# Altium schematic sheet stm32f407.SchDoc
size A3
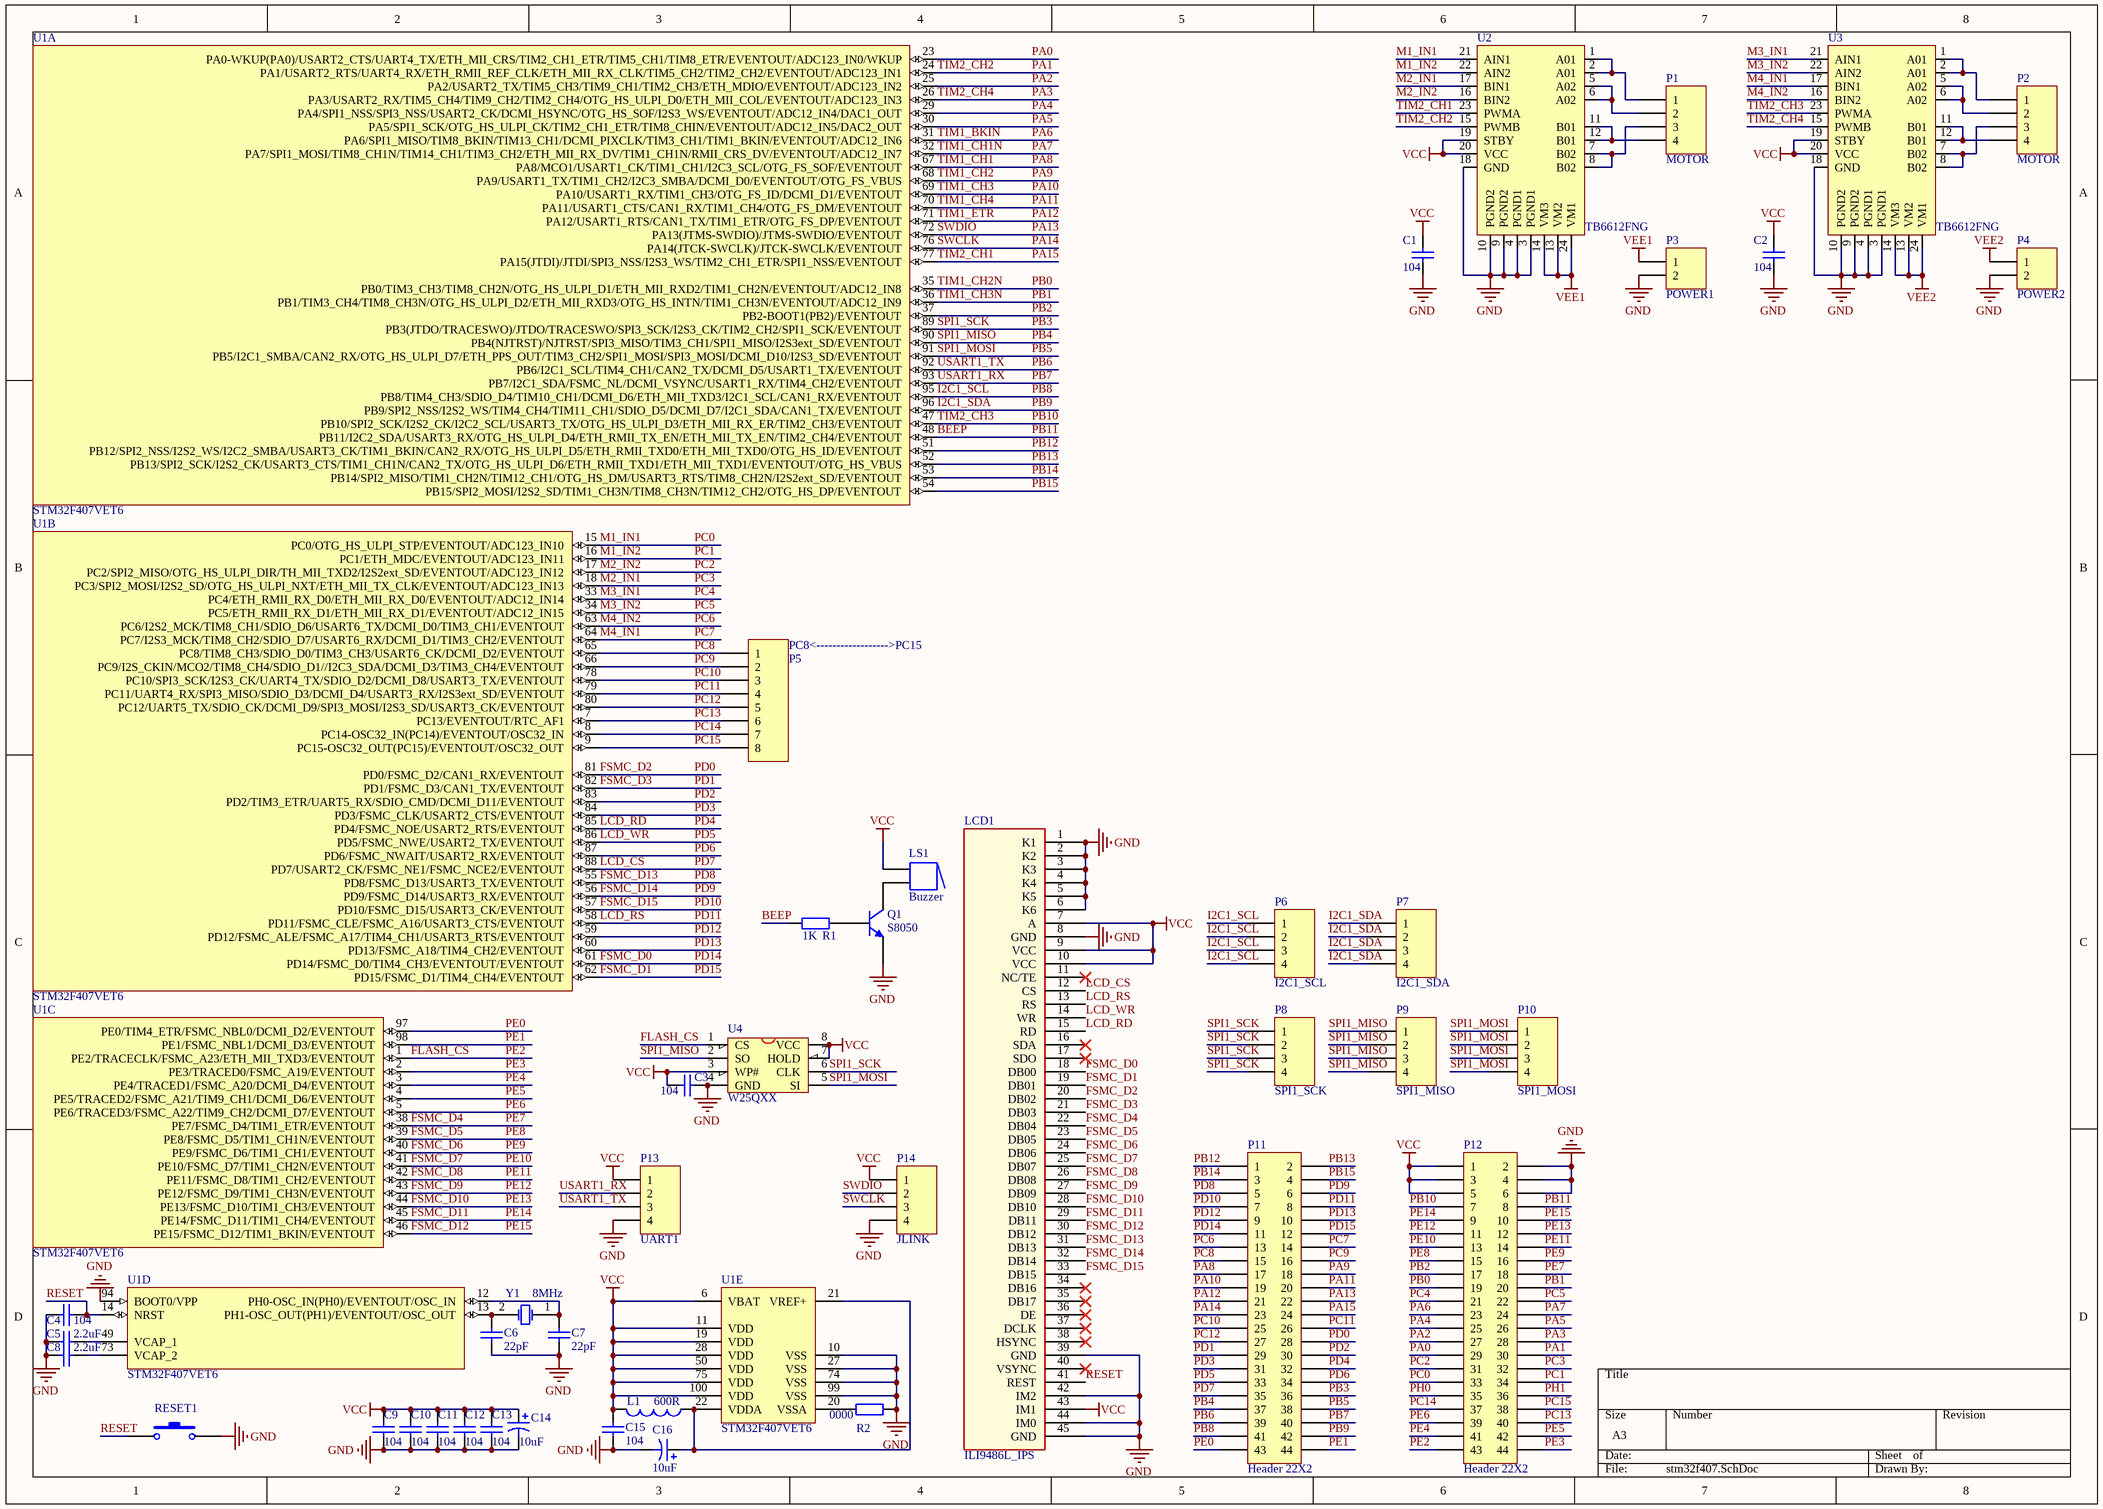
[diagram p0: stm32f407.SchDoc]

## Parts
C1  104  [C_0603]
C2  104  [C_0603]
C3  104  [C_0603]
C4  104  [C_0603]
C5  2.2uF  [C_0603]
C6  22pF  [C_0603]
C7  22pF  [C_0603]
C8  2.2uF  [C_0603]
C9  104  [C_0603]
C10  104  [C_0603]
C11  104  [C_0603]
C12  104  [C_0603]
C13  104  [C_0603]
C14  10uF  [TAC_3216]
C15  104  [C_0603]
C16  10uF  [TAC_3216]
L1  600R  [R_0603]
LCD1  ILI9486L_IPS  [ili9486l_裸屏]
LS1  Buzzer  [BEEP]
P1  MOTOR  [XH_4]
P2  MOTOR  [XH_4]
P3  POWER1  [KF2EDGK_2P]
P4  POWER2  [MHDR1X2]
P5  PC8<------------------>PC15  [PIN_8]
P6  I2C1_SCL  [PIN_4]
P7  I2C1_SDA  [PIN_4]
P8  SPI1_SCK  [PIN_4]
P9  SPI1_MISO  [PIN_4]
P10  SPI1_MOSI  [PIN_4]
P11  Header 22X2  [HDR2X22]
P12  Header 22X2  [HDR2X22]
P13  UART1  [1.25mm_4P]
P14  JLINK  [1.25mm_4P]
Q1  S8050  [SOT_23_3]
R1  1K  [R_0603]
R2  0000  [R_0603]
RESET1  RESET  [micro button_2_SMD]  (value not drawn)
U1  STM32F407VET6  [LQFP100_V]  (parts A,B,C,D,E of 5)
U2  TB6612FNG  [SSOP24]
U3  TB6612FNG  [SSOP24]
U4  W25QXX  [SOIC_8]
Y1  8MHz  [Crystal_HC_49USMD]

## Nets
GND: C1.1 C2.1 C3.1 C4.1 C5.2 C6.1 C7.1 C8.2 C9.1 C10.1 C11.1 C12.1 C13.1 C14.2 C15.1 C16.2 LCD1.1(K1) LCD1.2(K2) LCD1.3(K3) LCD1.4(K4) LCD1.5(K5) LCD1.6(K6) LCD1.8(GND) LCD1.39(GND) LCD1.42(IM2) LCD1.44(IM0) LCD1.45(GND) P3.2 P4.2 P12.2 P12.4 P12.6 P13.4 P14.4 Q1.2(E) R2.1 RESET1.2 U1.10(VSS) U1.27(VSS) U1.74(VSS) U1.94(BOOT0/VPP) U1.99(VSS) U2.3(PGND1) U2.4(PGND1) U2.9(PGND2) U2.10(PGND2) U2.18(GND) U3.3(PGND1) U3.4(PGND1) U3.9(PGND2) U3.10(PGND2) U3.18(GND) U4.4(GND)
VCC: C1.2 C2.2 C3.2 C9.2 C10.2 C11.2 C12.2 C13.2 C14.1 C15.2 L1.2 LCD1.7(A) LCD1.9(VCC) LCD1.10(VCC) LCD1.43(IM1) LS1.1 P12.1 P12.3 P12.5 P13.1 P14.1 U1.6(VBAT) U1.11(VDD) U1.19(VDD) U1.28(VDD) U1.50(VDD) U1.75(VDD) U1.100(VDD) U2.19(STBY) U2.20(VCC) U3.19(STBY) U3.20(VCC) U4.3(WP#) U4.7(HOLD) U4.8(VCC)
VEE1: P3.1 U2.13(VM2) U2.14(VM3) U2.24(VM1)
VEE2: P4.1 U3.13(VM2) U3.14(VM3) U3.24(VM1)
BEEP: P12.8 R1.2 U1.48(PB11/I2C2_SDA/USART3_RX/OTG_HS_ULPI_D4/ETH_RMII_TX_EN/ETH_MII_TX_EN/TIM2_CH4/EVENTOUT)  [also labelled PB11]
FLASH_CS: P12.43 U1.1(PE2/TRACECLK/FSMC_A23/ETH_MII_TXD3/EVENTOUT) U4.1(CS)  [also labelled PE2]
FSMC_D0: LCD1.18(DB00) P11.11 U1.61(PD14/FSMC_D0/TIM4_CH3/EVENTOUT/EVENTOUT)  [also labelled PD14]
FSMC_D1: LCD1.19(DB01) P11.12 U1.62(PD15/FSMC_D1/TIM4_CH4/EVENTOUT)  [also labelled PD15]
FSMC_D2: LCD1.20(DB02) P11.28 U1.81(PD0/FSMC_D2/CAN1_RX/EVENTOUT)  [also labelled PD0]
FSMC_D3: LCD1.21(DB03) P11.29 U1.82(PD1/FSMC_D3/CAN1_TX/EVENTOUT)  [also labelled PD1]
FSMC_D4: LCD1.22(DB04) P12.18 U1.38(PE7/FSMC_D4/TIM1_ETR/EVENTOUT)  [also labelled PE7]
FSMC_D5: LCD1.23(DB05) P12.15 U1.39(PE8/FSMC_D5/TIM1_CH1N/EVENTOUT)  [also labelled PE8]
FSMC_D6: LCD1.24(DB06) P12.16 U1.40(PE9/FSMC_D6/TIM1_CH1/EVENTOUT)  [also labelled PE9]
FSMC_D7: LCD1.25(DB07) P12.13 U1.41(PE10/FSMC_D7/TIM1_CH2N/EVENTOUT)  [also labelled PE10]
FSMC_D8: LCD1.26(DB08) P12.14 U1.42(PE11/FSMC_D8/TIM1_CH2/EVENTOUT)  [also labelled PE11]
FSMC_D9: LCD1.27(DB09) P12.11 U1.43(PE12/FSMC_D9/TIM1_CH3N/EVENTOUT)  [also labelled PE12]
FSMC_D10: LCD1.28(DB10) P12.12 U1.44(PE13/FSMC_D10/TIM1_CH3/EVENTOUT)  [also labelled PE13]
FSMC_D11: LCD1.29(DB11) P12.9 U1.45(PE14/FSMC_D11/TIM1_CH4/EVENTOUT)  [also labelled PE14]
FSMC_D12: LCD1.30(DB12) P12.10 U1.46(PE15/FSMC_D12/TIM1_BKIN/EVENTOUT)  [also labelled PE15]
FSMC_D13: LCD1.31(DB13) P11.5 U1.55(PD8/FSMC_D13/USART3_TX/EVENTOUT)  [also labelled PD8]
FSMC_D14: LCD1.32(DB14) P11.6 U1.56(PD9/FSMC_D14/USART3_RX/EVENTOUT)  [also labelled PD9]
FSMC_D15: LCD1.33(DB15) P11.7 U1.57(PD10/FSMC_D15/USART3_CK/EVENTOUT)  [also labelled PD10]
I2C1_SCL: P6.1 P6.2 P6.3 P6.4 P11.41 U1.95(PB8/TIM4_CH3/SDIO_D4/TIM10_CH1/DCMI_D6/ETH_MII_TXD3/I2C1_SCL/CAN1_RX/EVENTOUT)  [also labelled PB8]
I2C1_SDA: P7.1 P7.2 P7.3 P7.4 P11.42 U1.96(PB9/SPI2_NSS/I2S2_WS/TIM4_CH4/TIM11_CH1/SDIO_D5/DCMI_D7/I2C1_SDA/CAN1_TX/EVENTOUT)  [also labelled PB9]
LCD_CS: LCD1.12(CS) P11.35 U1.88(PD7/USART2_CK/FSMC_NE1/FSMC_NCE2/EVENTOUT)  [also labelled PD7]
LCD_RD: LCD1.15(RD) P11.32 U1.85(PD4/FSMC_NOE/USART2_RTS/EVENTOUT)  [also labelled PD4]
LCD_RS: LCD1.13(RS) P11.8 U1.58(PD11/FSMC_CLE/FSMC_A16/USART3_CTS/EVENTOUT)  [also labelled PD11]
LCD_WR: LCD1.14(WR) P11.33 U1.86(PD5/FSMC_NWE/USART2_TX/EVENTOUT)  [also labelled PD5]
M1_IN1: P12.33 U1.15(PC0/OTG_HS_ULPI_STP/EVENTOUT/ADC123_IN10) U2.21(AIN1)  [also labelled PC0]
M1_IN2: P12.34 U1.16(PC1/ETH_MDC/EVENTOUT/ADC123_IN11) U2.22(AIN2)  [also labelled PC1]
M2_IN1: P12.32 U1.18(PC3/SPI2_MOSI/I2S2_SD/OTG_HS_ULPI_NXT/ETH_MII_TX_CLK/EVENTOUT/ADC123_IN13) U2.17(BIN1)  [also labelled PC3]
M2_IN2: P12.31 U1.17(PC2/SPI2_MISO/OTG_HS_ULPI_DIR/TH_MII_TXD2/I2S2ext_SD/EVENTOUT/ADC123_IN12) U2.16(BIN2)  [also labelled PC2]
M3_IN1: P12.21 U1.33(PC4/ETH_RMII_RX_D0/ETH_MII_RX_D0/EVENTOUT/ADC12_IN14) U3.21(AIN1)  [also labelled PC4]
M3_IN2: P12.22 U1.34(PC5/ETH_RMII_RX_D1/ETH_MII_RX_D1/EVENTOUT/ADC12_IN15) U3.22(AIN2)  [also labelled PC5]
M4_IN1: P11.14 U1.64(PC7/I2S3_MCK/TIM8_CH2/SDIO_D7/USART6_RX/DCMI_D1/TIM3_CH2/EVENTOUT) U3.17(BIN1)  [also labelled PC7]
M4_IN2: P11.13 U1.63(PC6/I2S2_MCK/TIM8_CH1/SDIO_D6/USART6_TX/DCMI_D0/TIM3_CH1/EVENTOUT) U3.16(BIN2)  [also labelled PC6]
PA0: P12.29 U1.23(PA0-WKUP(PA0)/USART2_CTS/UART4_TX/ETH_MII_CRS/TIM2_CH1_ETR/TIM5_CH1/TIM8_ETR/EVENTOUT/ADC123_IN0/WKUP)
PA1: P12.30 U1.24(PA1/USART2_RTS/UART4_RX/ETH_RMII_REF_CLK/ETH_MII_RX_CLK/TIM5_CH2/TIM2_CH2/EVENTOUT/ADC123_IN1) U2.15(PWMB)  [also labelled TIM2_CH2]
PA2: P12.27 U1.25(PA2/USART2_TX/TIM5_CH3/TIM9_CH1/TIM2_CH3/ETH_MDIO/EVENTOUT/ADC123_IN2)
PA3: P12.28 U1.26(PA3/USART2_RX/TIM5_CH4/TIM9_CH2/TIM2_CH4/OTG_HS_ULPI_D0/ETH_MII_COL/EVENTOUT/ADC123_IN3) U3.15(PWMB)  [also labelled TIM2_CH4]
PA4: P12.25 U1.29(PA4/SPI1_NSS/SPI3_NSS/USART2_CK/DCMI_HSYNC/OTG_HS_SOF/I2S3_WS/EVENTOUT/ADC12_IN4/DAC1_OUT)
PA5: P12.26 U1.30(PA5/SPI1_SCK/OTG_HS_ULPI_CK/TIM2_CH1_ETR/TIM8_CHIN/EVENTOUT/ADC12_IN5/DAC2_OUT)
PA6: P12.23 U1.31(PA6/SPI1_MISO/TIM8_BKIN/TIM13_CH1/DCMI_PIXCLK/TIM3_CH1/TIM1_BKIN/EVENTOUT/ADC12_IN6)  [also labelled TIM1_BKIN]
PA7: P12.24 U1.32(PA7/SPI1_MOSI/TIM8_CH1N/TIM14_CH1/TIM3_CH2/ETH_MII_RX_DV/TIM1_CH1N/RMII_CRS_DV/EVENTOUT/ADC12_IN7)  [also labelled TIM1_CH1N]
PA8: P11.17 U1.67(PA8/MCO1/USART1_CK/TIM1_CH1/I2C3_SCL/OTG_FS_SOF/EVENTOUT)  [also labelled TIM1_CH1]
PA9: P11.18 U1.68(PA9/USART1_TX/TIM1_CH2/I2C3_SMBA/DCMI_D0/EVENTOUT/OTG_FS_VBUS)  [also labelled TIM1_CH2]
PA10: P11.19 U1.69(PA10/USART1_RX/TIM1_CH3/OTG_FS_ID/DCMI_D1/EVENTOUT)  [also labelled TIM1_CH3]
PA11: P11.20 U1.70(PA11/USART1_CTS/CAN1_RX/TIM1_CH4/OTG_FS_DM/EVENTOUT)  [also labelled TIM1_CH4]
PA12: P11.21 U1.71(PA12/USART1_RTS/CAN1_TX/TIM1_ETR/OTG_FS_DP/EVENTOUT)  [also labelled TIM1_ETR]
PA13: P11.22 P14.2 U1.72(PA13(JTMS-SWDIO)/JTMS-SWDIO/EVENTOUT)  [also labelled SWDIO]
PA14: P11.23 P14.3 U1.76(PA14(JTCK-SWCLK)/JTCK-SWCLK/EVENTOUT)  [also labelled SWCLK]
PA15: P11.24 U1.77(PA15(JTDI)/JTDI/SPI3_NSS/I2S3_WS/TIM2_CH1_ETR/SPI1_NSS/EVENTOUT) U2.23(PWMA)  [also labelled TIM2_CH1]
PB0: P12.19 U1.35(PB0/TIM3_CH3/TIM8_CH2N/OTG_HS_ULPI_D1/ETH_MII_RXD2/TIM1_CH2N/EVENTOUT/ADC12_IN8)  [also labelled TIM1_CH2N]
PB1: P12.20 U1.36(PB1/TIM3_CH4/TIM8_CH3N/OTG_HS_ULPI_D2/ETH_MII_RXD3/OTG_HS_INTN/TIM1_CH3N/EVENTOUT/ADC12_IN9)  [also labelled TIM1_CH3N]
PB2: P12.17 U1.37(PB2-BOOT1(PB2)/EVENTOUT)
PB3: P8.1 P8.2 P8.3 P8.4 P11.36 U1.89(PB3(JTDO/TRACESWO)/JTDO/TRACESWO/SPI3_SCK/I2S3_CK/TIM2_CH2/SPI1_SCK/EVENTOUT) U4.6(CLK)  [also labelled SPI1_SCK]
PB4: P9.1 P9.2 P9.3 P9.4 P11.37 U1.90(PB4(NJTRST)/NJTRST/SPI3_MISO/TIM3_CH1/SPI1_MISO/I2S3ext_SD/EVENTOUT) U4.2(SO)  [also labelled SPI1_MISO]
PB5: P10.1 P10.2 P10.3 P10.4 P11.38 U1.91(PB5/I2C1_SMBA/CAN2_RX/OTG_HS_ULPI_D7/ETH_PPS_OUT/TIM3_CH2/SPI1_MOSI/SPI3_MOSI/DCMI_D10/I2S3_SD/EVENTOUT) U4.5(SI)  [also labelled SPI1_MOSI]
PB6: P11.39 P13.3 U1.92(PB6/I2C1_SCL/TIM4_CH1/CAN2_TX/DCMI_D5/USART1_TX/EVENTOUT)  [also labelled USART1_TX]
PB7: P11.40 P13.2 U1.93(PB7/I2C1_SDA/FSMC_NL/DCMI_VSYNC/USART1_RX/TIM4_CH2/EVENTOUT)  [also labelled USART1_RX]
PB10: P12.7 U1.47(PB10/SPI2_SCK/I2S2_CK/I2C2_SCL/USART3_TX/OTG_HS_ULPI_D3/ETH_MII_RX_ER/TIM2_CH3/EVENTOUT) U3.23(PWMA)  [also labelled TIM2_CH3]
PB12: P11.1 U1.51(PB12/SPI2_NSS/I2S2_WS/I2C2_SMBA/USART3_CK/TIM1_BKIN/CAN2_RX/OTG_HS_ULPI_D5/ETH_RMII_TXD0/ETH_MII_TXD0/OTG_HS_ID/EVENTOUT)
PB13: P11.2 U1.52(PB13/SPI2_SCK/I2S2_CK/USART3_CTS/TIM1_CH1N/CAN2_TX/OTG_HS_ULPI_D6/ETH_RMII_TXD1/ETH_MII_TXD1/EVENTOUT/OTG_HS_VBUS)
PB14: P11.3 U1.53(PB14/SPI2_MISO/TIM1_CH2N/TIM12_CH1/OTG_HS_DM/USART3_RTS/TIM8_CH2N/I2S2ext_SD/EVENTOUT)
PB15: P11.4 U1.54(PB15/SPI2_MOSI/I2S2_SD/TIM1_CH3N/TIM8_CH3N/TIM12_CH2/OTG_HS_DP/EVENTOUT)
PC8: P5.1 P11.15 U1.65(PC8/TIM8_CH3/SDIO_D0/TIM3_CH3/USART6_CK/DCMI_D2/EVENTOUT)
PC9: P5.2 P11.16 U1.66(PC9/I2S_CKIN/MCO2/TIM8_CH4/SDIO_D1//I2C3_SDA/DCMI_D3/TIM3_CH4/EVENTOUT)
PC10: P5.3 P11.25 U1.78(PC10/SPI3_SCK/I2S3_CK/UART4_TX/SDIO_D2/DCMI_D8/USART3_TX/EVENTOUT)
PC11: P5.4 P11.26 U1.79(PC11/UART4_RX/SPI3_MISO/SDIO_D3/DCMI_D4/USART3_RX/I2S3ext_SD/EVENTOUT)
PC12: P5.5 P11.27 U1.80(PC12/UART5_TX/SDIO_CK/DCMI_D9/SPI3_MOSI/I2S3_SD/USART3_CK/EVENTOUT)
PC13: P5.6 P12.40 U1.7(PC13/EVENTOUT/RTC_AF1)
PC14: P5.7 P12.37 U1.8(PC14-OSC32_IN(PC14)/EVENTOUT/OSC32_IN)
PC15: P5.8 P12.38 U1.9(PC15-OSC32_OUT(PC15)/EVENTOUT/OSC32_OUT)
PD2: P11.30 U1.83(PD2/TIM3_ETR/UART5_RX/SDIO_CMD/DCMI_D11/EVENTOUT)
PD3: P11.31 U1.84(PD3/FSMC_CLK/USART2_CTS/EVENTOUT)
PD6: P11.34 U1.87(PD6/FSMC_NWAIT/USART2_RX/EVENTOUT)
PD12: P11.9 U1.59(PD12/FSMC_ALE/FSMC_A17/TIM4_CH1/USART3_RTS/EVENTOUT)
PD13: P11.10 U1.60(PD13/FSMC_A18/TIM4_CH2/EVENTOUT)
PE0: P11.43 U1.97(PE0/TIM4_ETR/FSMC_NBL0/DCMI_D2/EVENTOUT)
PE1: P11.44 U1.98(PE1/FSMC_NBL1/DCMI_D3/EVENTOUT)
PE3: P12.44 U1.2(PE3/TRACED0/FSMC_A19/EVENTOUT)
PE4: P12.41 U1.3(PE4/TRACED1/FSMC_A20/DCMI_D4/EVENTOUT)
PE5: P12.42 U1.4(PE5/TRACED2/FSMC_A21/TIM9_CH1/DCMI_D6/EVENTOUT)
PE6: P12.39 U1.5(PE6/TRACED3/FSMC_A22/TIM9_CH2/DCMI_D7/EVENTOUT)
PH0: P12.35
PH1: P12.36
RESET: C4.2 LCD1.41(REST) RESET1.1 U1.14(NRST)
NetC5_1: C5.1 U1.49(VCAP_1)
NetC6_2: C6.2 U1.13(PH1-OSC_OUT(PH1)/EVENTOUT/OSC_OUT) Y1.2(OSC2)
NetC7_2: C7.2 U1.12(PH0-OSC_IN(PH0)/EVENTOUT/OSC_IN) Y1.1(OSC1)
NetC8_1: C8.1 U1.73(VCAP_2)
NetC16_1: C16.1 L1.1 U1.21(VREF+) U1.22(VDDA)
NetLS1_2: LS1.2 Q1.3(C)
NetP1_1: P1.1 U2.1(A01) U2.2(A01)
NetP1_2: P1.2 U2.5(A02) U2.6(A02)
NetP1_3: P1.3 U2.7(B02) U2.8(B02)
NetP1_4: P1.4 U2.11(B01) U2.12(B01)
NetP2_1: P2.1 U3.1(A01) U3.2(A01)
NetP2_2: P2.2 U3.5(A02) U3.6(A02)
NetP2_3: P2.3 U3.7(B02) U3.8(B02)
NetP2_4: P2.4 U3.11(B01) U3.12(B01)
NetQ1_1: Q1.1(B) R1.1
NetR2_2: R2.2 U1.20(VSSA)

Not connected (* = marked no-connect by the designer): LCD1 11(NC/TE)* 16(SDA)* 17(SDO)* 34(DB16)* 35(DB17)* 36(DE)* 37(DCLK)* 38(HSYNC)* 40(VSYNC)*; LS1 1A 2A

## Library data of the parts
C1-C13 C15 = Cap: Capacitor; Published: 8-Jun-2000; LatestRevisionDate: 17-Jul-2002; LatestRevisionNote: Re-released for DXP Platform.; PackageReference: RAD-0.3; Publisher: Altium Limited; PackageDescription: Radial Cap, Thru-Hole; 2 Leads; 0.3 in Pin Spacing
  C1-C4 C9-C13 C15: Value: 104
  C5 C8: Value: 2.2uF
  C6 C7: Value: 22pF
C14 C16 = Cap Pol1: Polarized Capacitor (Radial); Published: 8-Jun-2000; LatestRevisionDate: 17-Jul-2002; LatestRevisionNote: Re-released for DXP Platform.; PackageReference: RB7.6-15; Publisher: Altium Limited; PackageDescription: Polarized Capacitor (Radial); 2 Leads; Value: 10uF
L1 = Inductor: Code_IEC: 1005; Published: 8-Jun-2000; LatestRevisionDate: 29-May-2009; LatestRevisionNote: IPC-7351 Footprint Added.; PackageReference: 0402-A; Publisher: Altium Limited; PackageDescription: Chip Inductor; Code_JEITA: 0402; Value: 600R
LCD1 = TFT_3.5_Tiky_ODM
LS1 = Buzzer: Magnetic Transducer Buzzer; Published: 24-Mar-1999; LatestRevisionDate: 17-Dec-2003; LatestRevisionNote: Schematic revised, PCB Footprint replaced.; DatasheetVersion: 17-Dec-2003; PackageReference: ABSM-1574; Publisher: Altium Limited; PackageDescription: Magnetic Transducer Buzzer; ComponentLink1Description: Manufacturer Link; ComponentLink1URL: http://www.megastar.com/linecard/buzzmode/index.php
P1 P2 P6-P10 P13 P14 = Header 4: Header, 4-Pin; LatestRevisionDate: 17-Jul-2002; LatestRevisionNote: Re-released for DXP Platform.; Publisher: Altium Limited
P3 P4 = MHDR1X2: Header, 2-Pin; LatestRevisionDate: 17-Jul-2002; LatestRevisionNote: Re-released for DXP Platform.; Publisher: Altium Limited
P5 = Header 8: Header, 8-Pin; LatestRevisionDate: 17-Jul-2002; LatestRevisionNote: Re-released for DXP Platform.; Publisher: Altium Limited
P11 P12 = Header 22X2: Header, 22-Pin, Dual row; LatestRevisionDate: 17-Jul-2002; LatestRevisionNote: Re-released for DXP Platform.; Publisher: Altium Limited
Q1 = QNPN: NPN Bipolar Transistor; Published: 8-Jun-2000; LatestRevisionDate: 29-May-2009; LatestRevisionNote: IPC-7351 Footprint Added.; PackageVersion: Aug-1999; PackageReference: SOT-23B; Publisher: Altium Limited; PackageDescription: 3-Pin SOT-23 Package 0.95 mm Pitch, 2.4 mm Lead Span
R1 R2 = Res2: Resistor; Published: 8-Jun-2000; LatestRevisionDate: 17-Jul-2002; LatestRevisionNote: Re-released for DXP Platform.; PackageReference: AXIAL-0.4; Publisher: Altium Limited; PackageDescription: Axial Device, Thru-Hole; 2 Leads; 0.4 in Pin Spacing
  R1: Value: 1K
  R2: Value: 0000
RESET1 = SW-PB: Switch; Published: 24-Mar-1999; LatestRevisionDate: 17-Jul-2002; LatestRevisionNote: Re-released for DXP Platform.; PackageReference: SPST-2; Publisher: Altium Limited; PackageDescription: Switch; 2 Leads
U1 = STM32F407VET6: ARM Cortex-M4 32b MCU+FPU, 210DMIP, 512 kB Flash, 192+4 kB RAM, Camera, 82 I/Os, 100-pin LQFP, -40 to +85癈, Tray; Internal RAM: 192kB; Operating Frequency (Processor Speed): 168MHz; A/D Converter: 16x12-bit; D/A Converter: 2x12-bit; 16-bit Timers (IC/OC/PWM): 12x16-bit(24/24/30); 32-bit Timer (IC/OC/PWM): 2x32-bit (8/8/8); Other Timer Functions: 2xWDG, RTC, 24-bit down counter; Serial Interface: 3xSPI/2xI2S/2xI2C/3xUSART(IrDa, ISO7816)/3xUART/2xUSB OTG FS/HS, 2xCAN/Ethernet MAC10/100, SDIO; DatasheetVersion: rev2, Jan-2012; PackageVersion: 2012; PackageReference: LQFP100; PackageDescription: 100-Pin Low Profile Quad Flat Package, 14x14 mm Body, 0.5 mm Pitch; ComponentLink1Description: Manufacturer URL; ComponentLink1URL: http://www.st.com/; ComponentLink2Description: STM32F405/7 Datasheet; ComponentLink2URL: http://www.st.com/internet/com/TECHNICAL_RESOURCES/TECHNICAL_LITERATURE/DATASHEET/DM00037051.pdf; ComponentLink3Description: STM32F4 Web Page; ComponentLink3URL: http://www.st.com/internet/mcu/subclass/1521.jsp
U2 U3 = TB6612FNG: DC_MOTOR_DRIVER
U4 = W25X16: W25X16;SST25VF016;MX25L1605
Y1 = XTAL: Crystal Oscillator; Published: 8-Jun-2000; LatestRevisionDate: 17-Jul-2002; LatestRevisionNote: Re-released for DXP Platform.; PackageReference: R38; Publisher: Altium Limited; PackageDescription: Crystal, Thru-Hole; 2 Leads; Body 3.1 x 8.2 mm (Dia.xH)